# Altium project 理想整流桥.PrjPcb
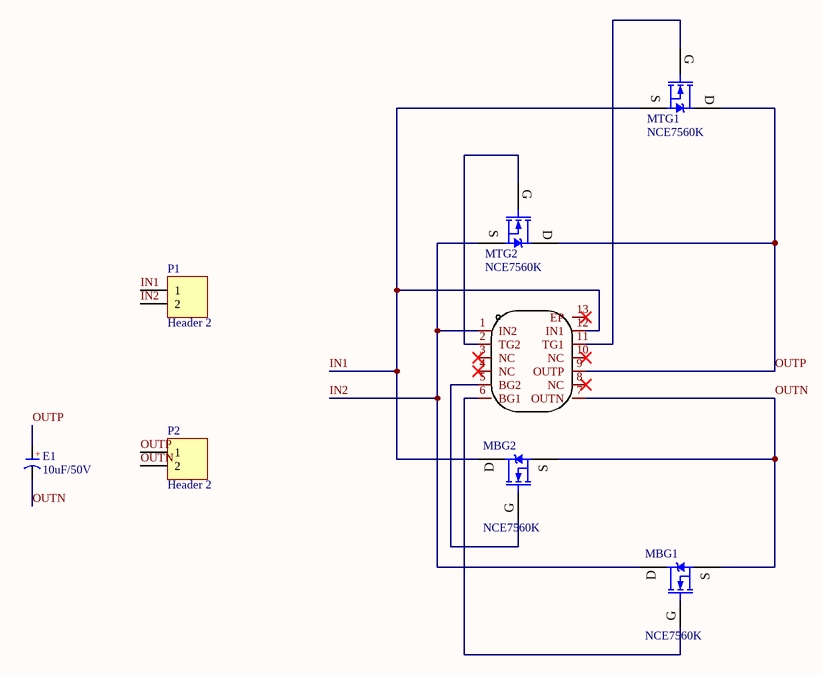
[diagram p0: 理想整流桥.SchDoc]
1 sheet, 8 parts. Net scope: global (net labels, ports and power ports of the same name join across sheets).
Board file: 理想整流桥.PcbDoc

## Sheet 理想整流桥.SchDoc
size A4

### Parts
E1  10uF/50V  [CD D(7343)]
MBG1  NCE7560K  [TO252]
MBG2  NCE7560K  [TO252]
MTG1  NCE7560K  [TO252]
MTG2  NCE7560K  [TO252]
P1  Header 2  [KF2EDGK5.08-WI-2P]
P2  Header 2  [KF2EDGK5.08-WI-2P]
U??  LT4320IMSE#PBF  [MSOP-12_L4.0-W3.0-P0.65-LS4.9-BL-EP]  (value not drawn)

### Nets
IN1: MBG2.2(D) MTG1.3(S) P1.1 U??.12(IN1)
IN2: MBG1.2(D) MTG2.3(S) P1.2 U??.1(IN2)
OUTN: E1.2(K) MBG1.3(S) MBG2.3(S) P2.2 U??.7(OUTN)
OUTP: E1.1(A) MTG1.2(D) MTG2.2(D) P2.1 U??.9(OUTP)
NetMBG1_1: MBG1.1(G) U??.6(BG1)
NetMBG2_1: MBG2.1(G) U??.5(BG2)
NetMTG1_1: MTG1.1(G) U??.11(TG1)
NetMTG2_1: MTG2.1(G) U??.2(TG2)

Not connected (* = marked no-connect by the designer): U?? 3(NC)* 4(NC)* 8(NC)* 10(NC)* 13(EP)*

### Notes on the sheet
- (in symbol CT) +

### Library data of the parts
E1 = CT: 贴片钽电容; 淘宝ID: 封装库来自淘宝 ID：黄晶宝石; BOM名称: 贴片钽电容; 联系售后: https://item.taobao.com/item.htm?id=566775463719
MBG1 MBG2 MTG1 MTG2 = IRF3710: N沟场效应管; 版权归属: 封装库来自淘宝 ID：黄晶宝石; BOM名称: N沟场效应管; 技术支持，联系售后: https://item.taobao.com/item.htm?id=566775463719
P1 P2 = Header 2: Header, 2-Pin; LatestRevisionDate: 17-Jul-2002; LatestRevisionNote: Re-released for DXP Platform.; Publisher: Altium Limited
U?? = LT4320IMSE#PBF: Add into BOM: yes; Name: LT4320IMSE#PBF; Symbol: LT4320IMSE#PBF; Device: LT4320IMSE#PBF; LCSC Part Name: LT4320IMSE#PBF; Supplier Part: C580181; Manufacturer Part: LT4320IMSE#PBF; Supplier Footprint: MSOP-12-EP-0.65mm; JLCPCB Part Class: Extended Part; Datasheet: https://atta.szlcsc.com/upload/public/pdf/source/20200904/C672451_3866601E11BCA9D43DEBB9978F5AD036.pdf; Supplier: LCSC; Convert to PCB: yes